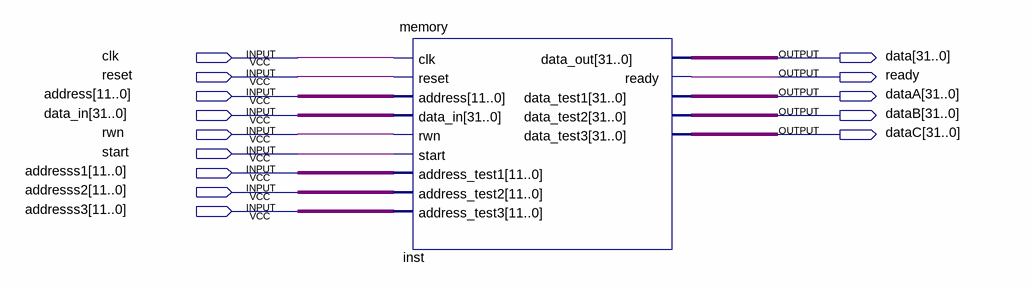
[diagram p0: schematic sheet]
// Quartus schematic test.bdf as structural Verilog: 1 symbols, 14 pins
module test (
  input  clk,
  input  reset,
  input  [11:0] address,
  input  [31:0] data_in,
  input  rwn,
  input  start,
  input  [11:0] addresss1,
  input  [11:0] addresss2,
  input  [11:0] addresss3,
  output [31:0] data,
  output ready,
  output [31:0] dataA,
  output [31:0] dataB,
  output [31:0] dataC
);

  memory inst (
    .clk(clk), .reset(reset), .address(address), .data_in(data_in), .rwn(rwn), .start(start),
    .address_test1(addresss1), .address_test2(addresss2), .address_test3(addresss3), .data_out(data),
    .ready(ready), .data_test1(dataA), .data_test2(dataB), .data_test3(dataC));
endmodule
